# EAGLE design buttons (EAGLE 7.2.0)
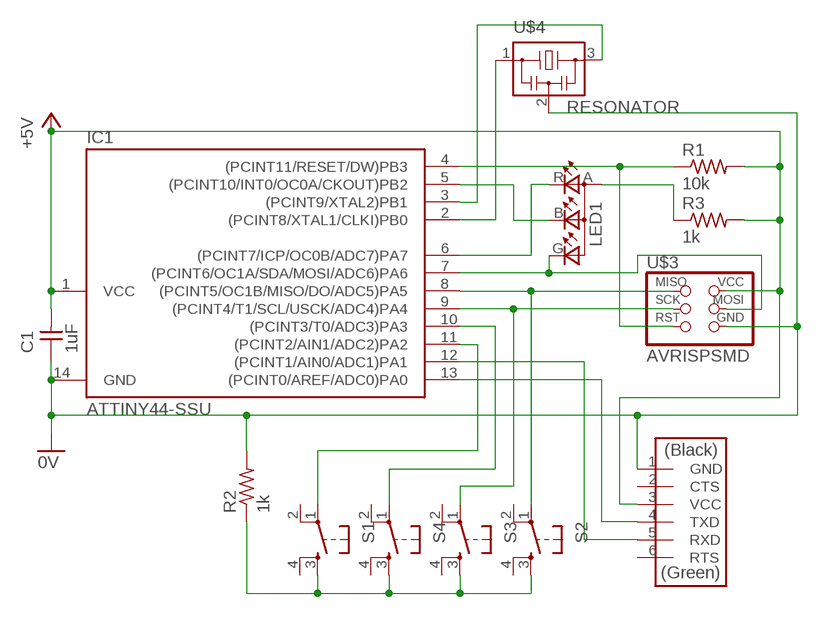
[diagram p0: schematic, sheet 1]

## Parts
C1  1uF  CAP-UNPOLARIZEDFAB  [C1206FAB]
IC1  ATTINY44-SSU  [SOIC14]
LED1  LEDRGBOLD  [P-LCC-4-3]
R1  10k  RES-US1206FAB  [R1206FAB]
R2  1k  RES-US1206FAB  [R1206FAB]
R3  1k  RES-US1206FAB  [R1206FAB]
S1  6MM_SWITCH6MM_SWITCH  [6MM_SWITCH]
S2  6MM_SWITCH6MM_SWITCH  [6MM_SWITCH]
S3  6MM_SWITCH6MM_SWITCH  [6MM_SWITCH]
S4  6MM_SWITCH6MM_SWITCH  [6MM_SWITCH]
U$2  FTDI-SMD-HEADER  [1X06SMD]
U$3  AVRISPSMD  [2X03SMD]
U$4  RESONATOR  [EFOBM]

## Nets
0V: C1.1 IC1.14(GND) R2.2 U$2.1(GND) U$3.6(GND) U$4.2
+5V: C1.2 IC1.1(VCC) R1.2 R3.2 U$2.3(VCC) U$3.2(VCC)
N$1: IC1.3((PCINT9/XTAL2)PB1) U$4.3
N$2: IC1.2((PCINT8/XTAL1/CLKI)PB0) U$4.1
N$3: IC1.9((PCINT4/T1/SCL/USCK/ADC4)PA4) S3.1(P) U$3.3(SCK)
N$4: IC1.8((PCINT5/OC1B/MISO/DO/ADC5)PA5) S2.1(P) U$3.1(MISO)
N$5: IC1.7((PCINT6/OC1A/SDA/MOSI/ADC6)PA6) LED1.G(CGREEN) U$3.4(MOSI)
N$6: IC1.4((PCINT11/RESET/DW)PB3) R1.1 U$3.5(RST)
N$7: IC1.5((PCINT10/INT0/OC0A/CKOUT)PB2) LED1.B(CBLUE)
N$8: IC1.13((PCINT0/AREF/ADC0)PA0) U$2.4(TXD)
N$9: IC1.12((PCINT1/AIN0/ADC1)PA1) U$2.5(RXD)
N$10: IC1.6((PCINT7/ICP/OC0B/ADC7)PA7) LED1.R(CRED)
N$11: LED1.A(A2) R3.1
N$12: IC1.10((PCINT3/T0/ADC3)PA3) S4.1(P)
N$13: IC1.11((PCINT2/AIN1/ADC2)PA2) S1.1(P)
N$14: R2.1 S1.3(S) S2.3(S) S3.3(S) S4.3(S)
Unconnected: S1.2(P1) S1.4(S1) S2.2(P1) S2.4(S1) S3.2(P1) S3.4(S1) S4.2(P1) S4.4(S1) U$2.2(CTS) U$2.6(RTS)

## Library data of the parts
C1 = fab2015:CAP-UNPOLARIZED
IC1 = fab2015:ATTINY44
LED1 = fab2015:LEDRGBOLD: OSRAM Hyper Multi TOPLED® Hyper-Bright LED LATB T686 Source: http://www.osram.convergy.de/
R1-R3 = fab2015:RES-US: Resistor (US Symbol) Variants with postfix FAB are widened to allow the routing of internal traces
S1-S4 = fab2015:6MM_SWITCH: OMRON SWITCH
U$2 = fab2015:FTDI-SMD-HEADER
U$3 = fab2015:AVRISP
U$4 = fab2015:RESONATOR

## Board
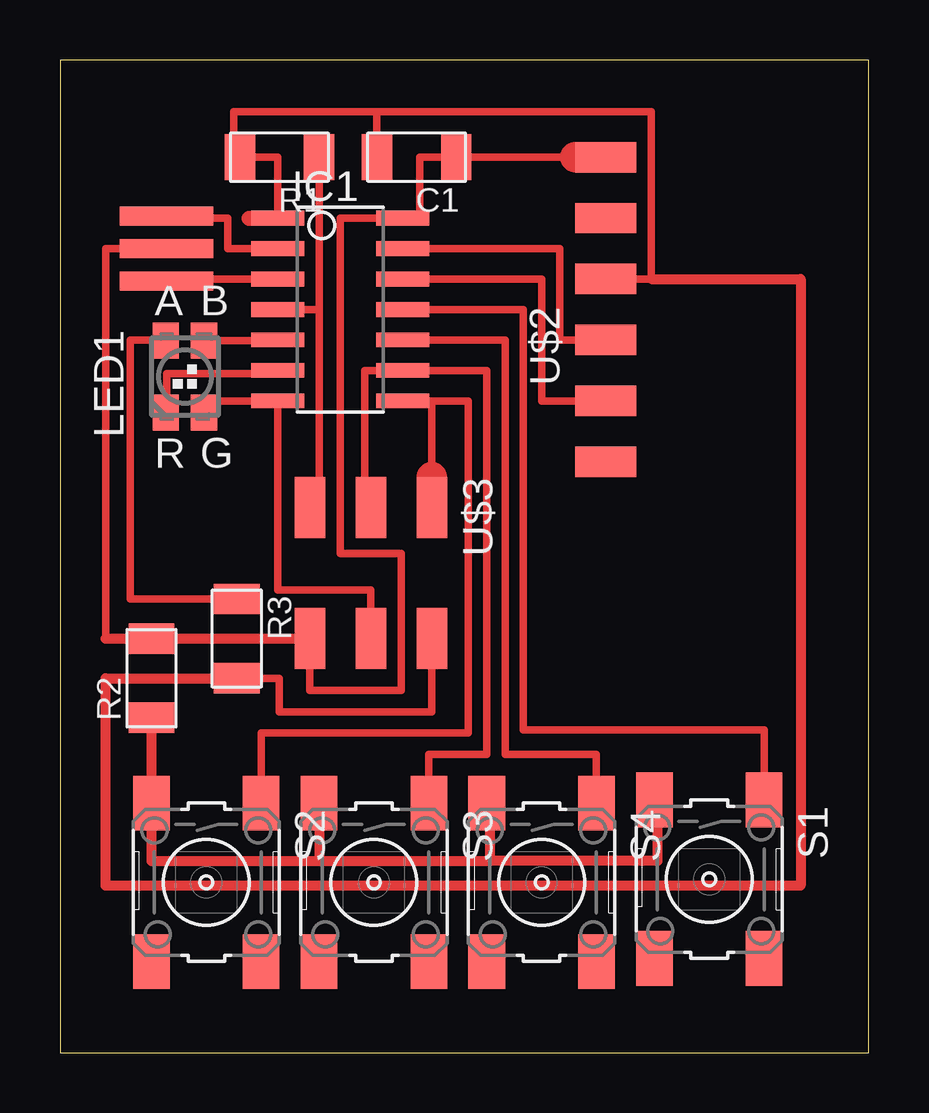
[diagram p1: board, top side]

Size 33.71 x 41.39 mm. Coordinates in mm from the lower left corner, seen from the top.
Outline: 0,0 33.71,0 33.71,41.39 0,41.39 0,0
Copper layers (1*16): Top 0.035mm / dielectric 1.5mm / Bottom 0.035mm
Design rules "default": minimum track width 10mil, minimum drill 24mil, track to track 8mil, track to pad 8mil, pad to pad 8mil, via to via 8mil, smd to smd 8mil, copper to edge 40mil, drill to drill 8mil, minimum pad ring 10mil, minimum via ring 8mil, stop-mask expansion 4mil, vias tented up to drill 0mil, thermal gap 10mil

### Footprints (pad centres in the part's own frame; a part is rotated, then mirrored left to right if it is on the bottom)
C1206FAB = smd 1.27 x 1.905: 1 -1.651,0; 2 1.651,0
SOIC14 = smd 0.61 x 2.21: 1 -3.81,-2.603; 2 -2.54,-2.603; 3 -1.27,-2.603; 4 0,-2.603; 5 1.27,-2.603; 6 2.54,-2.603; 7 3.81,-2.603; 8 3.81,2.603; 9 2.54,2.603; 10 1.27,2.603; 11 0,2.603; 12 -1.27,2.603; 13 -2.54,2.603; 14 -3.81,2.603
P-LCC-4-3 = smd 1.1 x 1.5: A -0.8,1.5; B 0.8,1.5; G 0.8,-1.5; R -0.8,-1.5
R1206FAB = smd 1.27 x 1.905: 1 -1.651,0; 2 1.651,0
6MM_SWITCH = smd 2.286 x 1.524: 1 -3.302,2.286; 2 3.302,2.286; 3 -3.302,-2.286; 4 3.302,-2.286
1X06SMD = smd 2.54 x 1.27: 1 0,6.35; 2 0,3.81; 3 0,1.27; 4 0,-1.27; 5 0,-3.81; 6 0,-6.35
2X03SMD = smd 2.54 x 1.27: 1 -2.54,2.54; 2 2.92,2.54; 3 -2.54,0; 4 2.92,0; 5 -2.54,-2.54; 6 2.92,-2.54
EFOBM = smd 0.8 x 3.9: 1 -1.35,0; 2 0,0; 3 1.35,0

### Placement (x,y rotation side)
C1  14.86,37.34 180 top
IC1  11.68,30.99 270 top
LED1  5.21,28.19 0 top
R1  9.14,37.34 180 top
R2  3.81,15.62 90 top
R3  7.37,17.27 270 top
S1  27.05,7.24 270 top
S2  6.1,7.11 270 top
S3  13.08,7.11 270 top
S4  20.07,7.11 270 top
U$2  22.73,30.99 0 top
U$3  12.95,20.19 270 top
U$4  4.45,33.53 270 top

### Tracks (layer width: path | path; a pad name or v marks a point on that pad's centre or on a via)
0V
  Top 0.305: U$3.6 10.41,15.11 14.22,15.11 14.22,20.83 11.68,20.83 11.68,34.8 IC1.14 14.99,34.8 14.99,37.34 C1.1 U$2.1 | U$4.2 1.91,33.53 1.91,17.27
  Top 0.406: 1.91,17.27 R2.2 U$3.6
+5V
  Top 0.305: IC1.1 9.08,37.34 R1.2 7.24,37.34 7.24,39.24 13.21,39.24 | 13.21,39.24 C1.2 | 13.21,39.24 24.64,39.24 24.64,32.26 U$2.3 | R3.2 9.14,15.62 9.14,14.22 15.49,14.22 U$3.2
  Top 0.406: R3.2 1.91,15.62 1.91,6.99 30.86,6.99 30.86,32.26 24.64,32.26
N$1
  Top 0.305: IC1.3 4.45,32.26 U$4.3
N$2
  Top 0.305: IC1.2 6.99,33.53 6.99,34.8 4.45,34.8 U$4.1
N$3
  Top 0.305: U$3.3 12.7,22.73 12.7,28.45 IC1.9 17.78,28.45 17.78,12.45 15.37,12.45 S3.1
N$4
  Top 0.305: IC1.8 15.49,27.18 | 15.49,27.18 U$3.1 | 15.49,27.18 17.02,27.18 17.02,13.34 8.38,13.34 S2.1
N$5
  Top 0.305: LED1.G 5.97,26.69 5.97,27.18 IC1.7 9.08,19.3 12.95,19.3 U$3.4
N$6
  Top 0.305: 11.05,37.34 R1.1 10.79,30.99 | U$3.5 10.79,22.73 10.79,30.99 | IC1.4 10.79,30.99
N$7
  Top 0.305: LED1.B 9.08,29.69 IC1.5
N$8
  Top 0.305: U$2.4 20.83,29.72 20.83,33.53 IC1.13
N$9
  Top 0.305: IC1.12 20.07,32.26 20.07,27.18 U$2.5
N$10
  Top 0.305: LED1.R 4.45,26.69 4.45,28.32 9.08,28.32 IC1.6
N$11
  Top 0.305: R3.1 2.92,18.92 2.92,29.72 4.41,29.72 LED1.A
N$12
  Top 0.305: IC1.10 18.54,29.72 18.54,12.45 22.35,12.45 S4.1
N$13
  Top 0.305: IC1.11 19.3,30.99 19.3,13.46 29.34,13.46 S1.1
N$14
  Top 0.406: R2.1 S2.3 3.81,8 10.79,8 | 10.79,8 17.4,8 17.91,8 | S3.3 10.79,8 | S4.3 17.91,10.41 17.91,8 | S1.3 24.89,10.54 24.89,8 17.91,8
N$15
  Top 1.27: 21.46,37.34 22.1,37.34
N$16
  Top 1.27: 15.49,23.37 15.49,24
N$17
  Top 0.635: 7.87,34.8 8.51,34.8